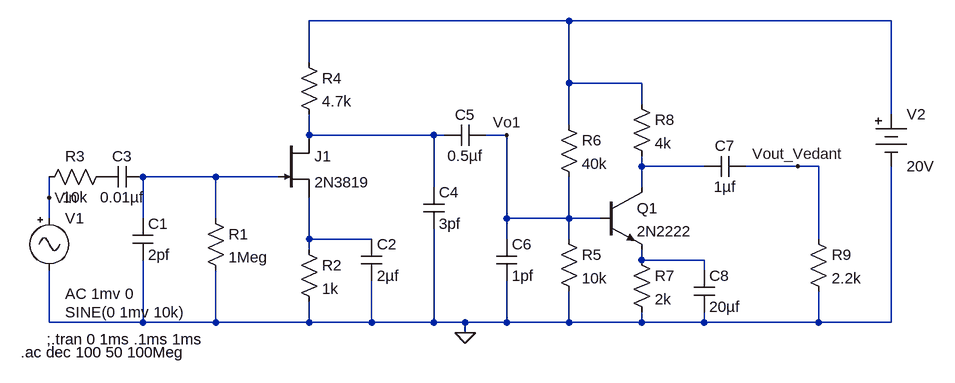
[diagram p0: schematic ECAD_exp3.asc]
ECAD_exp3.asc, the LTspice schematic file:
Version 4
SHEET 1 1252 680
WIRE 640 -112 240 -112
WIRE 1136 -112 640 -112
WIRE 240 -48 240 -112
WIRE 640 -16 640 -112
WIRE 752 -16 640 -16
WIRE 752 16 752 -16
WIRE 1136 32 1136 -112
WIRE 640 48 640 -16
WIRE 240 64 240 32
WIRE 432 64 240 64
WIRE 448 64 432 64
WIRE 544 64 512 64
WIRE 752 112 752 96
WIRE 848 112 752 112
WIRE 992 112 912 112
WIRE 1024 112 992 112
WIRE 96 128 -16 128
WIRE 192 128 96 128
WIRE 432 144 432 64
WIRE 752 144 752 112
WIRE -160 160 -160 128
WIRE -160 192 -160 160
WIRE -16 192 -16 128
WIRE 96 192 96 128
WIRE 544 192 544 64
WIRE 640 192 640 128
WIRE 640 192 544 192
WIRE 688 192 640 192
WIRE 240 224 240 160
WIRE 336 224 240 224
WIRE 544 224 544 192
WIRE 640 224 640 192
WIRE 1024 224 1024 112
WIRE 240 240 240 224
WIRE 752 256 752 240
WIRE 848 256 752 256
WIRE 848 272 848 256
WIRE -160 352 -160 272
WIRE -16 352 -16 256
WIRE -16 352 -160 352
WIRE 96 352 96 272
WIRE 96 352 -16 352
WIRE 240 352 240 320
WIRE 240 352 96 352
WIRE 336 352 336 288
WIRE 336 352 240 352
WIRE 432 352 432 208
WIRE 432 352 336 352
WIRE 480 352 432 352
WIRE 544 352 544 288
WIRE 544 352 480 352
WIRE 640 352 640 304
WIRE 640 352 544 352
WIRE 752 352 752 336
WIRE 752 352 640 352
WIRE 848 352 848 336
WIRE 848 352 752 352
WIRE 1024 352 1024 304
WIRE 1024 352 848 352
WIRE 1136 352 1136 112
WIRE 1136 352 1024 352
WIRE 480 368 480 352
FLAG 992 112 Vout_Vedant
FLAG -160 160 Vin
FLAG 544 64 Vo1
FLAG 480 368 0
SYMBOL res 80 176 R0
SYMATTR InstName R1
SYMATTR Value 1Meg
SYMBOL cap -32 192 R0
SYMATTR InstName C1
SYMATTR Value 2pf
SYMBOL cap 320 224 R0
SYMATTR InstName C2
SYMATTR Value 2µf
SYMBOL res 224 224 R0
SYMATTR InstName R2
SYMATTR Value 1k
SYMBOL njf 192 64 R0
SYMATTR InstName J1
SYMATTR Value 2N3819
SYMBOL Misc\\signal -160 176 R0
WINDOW 3 24 160 Left 2
WINDOW 123 24 132 Left 2
WINDOW 39 0 0 Left 0
SYMATTR InstName V1
SYMATTR Value SINE(0 1mv 10k)
SYMATTR Value2 AC 1mv 0
SYMBOL cap -16 112 R90
WINDOW 0 0 32 VBottom 2
WINDOW 3 32 32 VTop 2
SYMATTR InstName C3
SYMATTR Value 0.01µf
SYMBOL res -64 112 R90
WINDOW 0 0 56 VBottom 2
WINDOW 3 32 56 VTop 2
SYMATTR InstName R3
SYMATTR Value 10k
SYMBOL res 224 -64 R0
SYMATTR InstName R4
SYMATTR Value 4.7k
SYMBOL cap 416 144 R0
SYMATTR InstName C4
SYMATTR Value 3pf
SYMBOL cap 512 48 R90
WINDOW 0 0 32 VBottom 2
WINDOW 3 32 32 VTop 2
SYMATTR InstName C5
SYMATTR Value 0.5µf
SYMBOL cap 528 224 R0
SYMATTR InstName C6
SYMATTR Value 1pf
SYMBOL res 624 208 R0
SYMATTR InstName R5
SYMATTR Value 10k
SYMBOL res 624 32 R0
SYMATTR InstName R6
SYMATTR Value 40k
SYMBOL npn 688 144 R0
SYMATTR InstName Q1
SYMATTR Value 2N2222
SYMBOL res 736 240 R0
SYMATTR InstName R7
SYMATTR Value 2k
SYMBOL res 736 0 R0
SYMATTR InstName R8
SYMATTR Value 4k
SYMBOL res 1008 208 R0
SYMATTR InstName R9
SYMATTR Value 2.2k
SYMBOL cap 912 96 R90
WINDOW 0 0 32 VBottom 2
WINDOW 3 32 32 VTop 2
SYMATTR InstName C7
SYMATTR Value 1µf
SYMBOL cap 832 272 R0
SYMATTR InstName C8
SYMATTR Value 20µf
SYMBOL Misc\\battery 1136 16 R0
SYMATTR InstName V2
SYMATTR Value 20V
TEXT -164 378 Left 2 !;.tran 0 1ms .1ms 1ms
TEXT -204 398 Left 2 !.ac dec 100 50 100Meg

The netlist it stands for:
* ECAD_exp3.asc
R1 N004 0 1Meg
C1 N004 0 2pf
C2 N005 0 2µf
R2 N005 0 1k
J1 N002 N004 N005 2N3819
V1 Vin 0 SINE(0 1mv 10k) AC 1mv 0
C3 N004 P001 0.01µf
R3 P001 Vin 10k
R4 N001 N002 4.7k
C4 N002 0 3pf
C5 Vo1 N002 0.5µf
C6 Vo1 0 1pf
R5 Vo1 0 10k
R6 N001 Vo1 40k
Q1 N003 Vo1 N006 0 2N2222
R7 N006 0 2k
R8 N001 N003 4k
R9 Vout_Vedant 0 2.2k
C7 Vout_Vedant N003 1µf
C8 N006 0 20µf
V2 N001 0 20V
.model NPN NPN
.model PNP PNP
.lib standard.bjt
.model NJF NJF
.model PJF PJF
.lib standard.jft
;.tran 0 1ms .1ms 1ms
.ac dec 100 50 100Meg
.backanno
.end